# Altium schematic sheet MCU_power_input.SchDoc
size A4; SheetNumber: 3; SheetTotal: 10
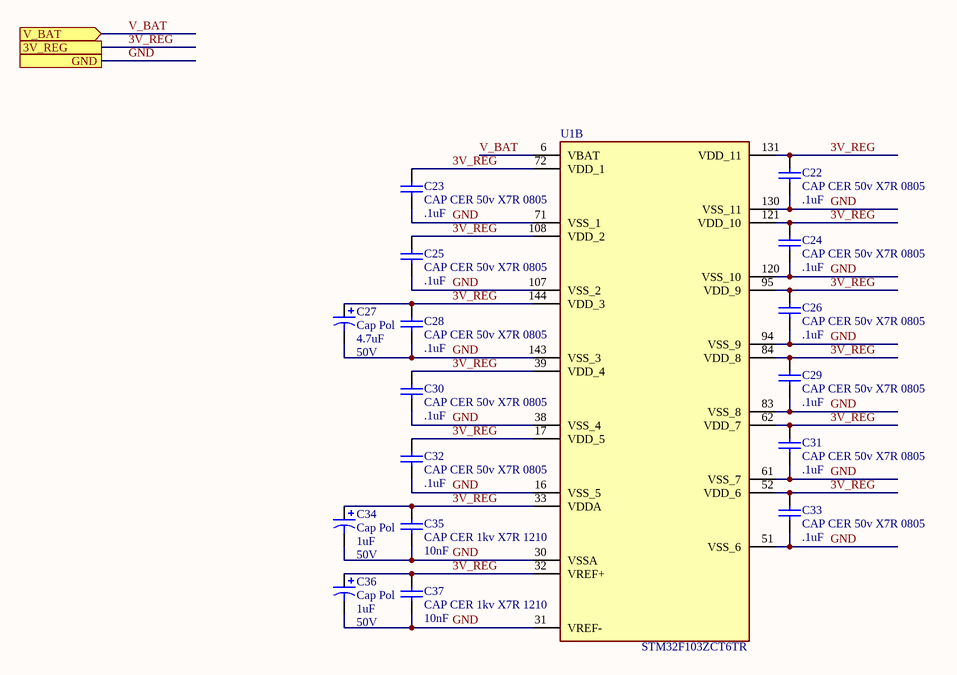
[diagram p0: MCU_power_input.SchDoc]

## Parts
C22  CAP CER 50v X7R 0805  value .1uF  [CAPC2012X09M]
C23  CAP CER 50v X7R 0805  value .1uF  [CAPC2012X09M]
C24  CAP CER 50v X7R 0805  value .1uF  [CAPC2012X09M]
C25  CAP CER 50v X7R 0805  value .1uF  [CAPC2012X09M]
C26  CAP CER 50v X7R 0805  value .1uF  [CAPC2012X09M]
C27  Cap Pol  value 4.7uF  Voltage: 50V  [CAPACITOR_5MM]
C28  CAP CER 50v X7R 0805  value .1uF  [CAPC2012X09M]
C29  CAP CER 50v X7R 0805  value .1uF  [CAPC2012X09M]
C30  CAP CER 50v X7R 0805  value .1uF  [CAPC2012X09M]
C31  CAP CER 50v X7R 0805  value .1uF  [CAPC2012X09M]
C32  CAP CER 50v X7R 0805  value .1uF  [CAPC2012X09M]
C33  CAP CER 50v X7R 0805  value .1uF  [CAPC2012X09M]
C34  Cap Pol  value 1uF  Voltage: 50V  [CAPACITOR_3MM]
C35  CAP CER 1kv X7R 1210  value 10nF  [CAPC3225X25M]
C36  Cap Pol  value 1uF  Voltage: 50V  [CAPACITOR_3MM]
C37  CAP CER 1kv X7R 1210  value 10nF  [CAPC3225X25M]
U1  STM32F103ZCT6TR  [QFP50P2200X2200X160-144N]  (part B of 2)

## Ports
3V_REG, GND, V_BAT (in)

## Nets
3V_REG: C22.2 C23.2 C24.2 C25.2 C26.2 C27.1 C28.2 C29.2 C30.2 C31.2 C32.2 C33.2 C34.1 C35.2 C36.1 C37.2 U1.17(VDD_5) U1.32(VREF+) U1.33(VDDA) U1.39(VDD_4) U1.52(VDD_6) U1.62(VDD_7) U1.72(VDD_1) U1.84(VDD_8) U1.95(VDD_9) U1.108(VDD_2) U1.121(VDD_10) U1.131(VDD_11) U1.144(VDD_3) ; port 3V_REG
GND: C22.1 C23.1 C24.1 C25.1 C26.1 C27.2 C28.1 C29.1 C30.1 C31.1 C32.1 C33.1 C34.2 C35.1 C36.2 C37.1 U1.16(VSS_5) U1.30(VSSA) U1.31(VREF-) U1.38(VSS_4) U1.51(VSS_6) U1.61(VSS_7) U1.71(VSS_1) U1.83(VSS_8) U1.94(VSS_9) U1.107(VSS_2) U1.120(VSS_10) U1.130(VSS_11) U1.143(VSS_3) ; port GND
V_BAT: U1.6(VBAT) ; port V_BAT

## Library data of the parts
C22-C26 C28-C33 = CAP-X7R-.1uF-50V-±5%: MPN: C0805C104J5RACTU; WV: 50; Tolerance: ±5%; PN: 399-1171-1-ND; Name: CAP-X7R-.1uF-50V-±5%; Type: X7R; URL: http://www.digikey.ca/product-detail/en/C0805C104J5RACTU/399-1171-1-ND
C27 = Cap Polar-4.7uF-50V: CAP 85C 4.7uF ±20% 50V WX Series Aluminum Electrolytic; MPN: UWX1H4R7MCL1GB; Tan Theta: 0.12; Leakage Current: 3; Rated Ripple Current: 20; PN: 493-2134-1-ND; Name: Cap Polar-4.7uF-50V; Diameter: 5; URL: http://www.digikey.ca/product-detail/en/UWX1H4R7MCL1GB/493-2134-1-ND
C34 C36 = Cap Polar-1uF-50V: CAP 85C 1uF ±20% 50V WX Series Aluminum Electrolytic; MPN: UWX1H010MCL2GB; Tan Theta: 0.12; Leakage Current: 3; Rated Ripple Current: 8; PN: 493-2129-1-ND; Name: Cap Polar-1uF-50V; Diameter: 3; URL: http://www.digikey.ca/product-detail/en/UWX1H010MCL2GB/493-2129-1-ND
C35 C37 = CAP-X7R-10000pF-1000V-±5%: MPN: C1210C103JDRACTU; WV: 1000; Tolerance: ±5%; PN: 399-5106-1-ND; Name: CAP-X7R-10000pF-1000V-±5%; Type: X7R; URL: http://www.digikey.ca/product-detail/en/C1210C103JDRACTU/399-5106-1-ND
U1 = STM32F103ZCT6TR: ARM® Cortex®-M3 series Microcontroller IC 32-Bit Single-Core 72MHz 256KB (256K x 8) FLASH 144-LQFP (20x20); MF: STMicroelectronics; Check_prices: https://www.snapeda.com/parts/STM32F103ZCT6TR/STMicroelectronics/view-part/?ref=eda; SnapEDA_Link: https://www.snapeda.com/parts/STM32F103ZCT6TR/STMicroelectronics/view-part/?ref=snap; MP: STM32F103ZCT6TR; Purchase-URL: https://pricing.snapeda.com/search/part/STM32F103ZCT6TR/?ref=eda; Digi-Key_Part_Number: 497-18761-2-ND; Package: LQFP-144 STMicroelectronics; Value: *